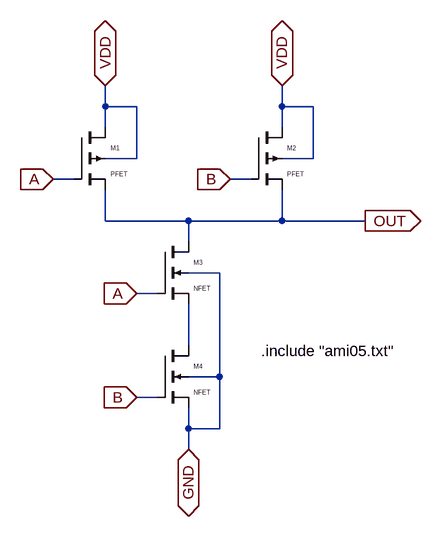
[diagram p0: schematic nand2.asc]
nand2.asc, the LTspice schematic file:
Version 4
SHEET 1 2772 1756
WIRE 784 752 784 720
WIRE 832 752 784 752
WIRE 1056 752 1056 720
WIRE 1104 752 1056 752
WIRE 784 784 784 752
WIRE 1056 784 1056 752
WIRE 832 832 832 752
WIRE 832 832 784 832
WIRE 1104 832 1104 752
WIRE 1104 832 1056 832
WIRE 736 864 704 864
WIRE 1008 864 976 864
WIRE 784 928 784 880
WIRE 912 928 784 928
WIRE 1056 928 1056 880
WIRE 1056 928 912 928
WIRE 1184 928 1056 928
WIRE 912 960 912 928
WIRE 960 1008 912 1008
WIRE 864 1040 832 1040
WIRE 912 1120 912 1056
WIRE 960 1168 960 1008
WIRE 960 1168 912 1168
WIRE 864 1200 832 1200
WIRE 912 1248 912 1216
WIRE 960 1248 960 1168
WIRE 960 1248 912 1248
WIRE 912 1280 912 1248
FLAG 912 1280 GND
IOPIN 912 1280 BiDir
FLAG 832 1040 A
IOPIN 832 1040 In
FLAG 832 1200 B
IOPIN 832 1200 In
FLAG 784 720 VDD
IOPIN 784 720 BiDir
FLAG 1056 720 VDD
IOPIN 1056 720 BiDir
FLAG 704 864 A
IOPIN 704 864 In
FLAG 976 864 B
IOPIN 976 864 In
FLAG 1184 928 OUT
IOPIN 1184 928 Out
SYMBOL nmos4 864 960 R0
WINDOW 0 56 32 Left 0
WINDOW 3 56 72 Left 0
SYMATTR InstName M3
SYMATTR Value NFET
SYMATTR Value2 l=0.6u w=3u
SYMBOL pmos4 736 784 R0
WINDOW 0 56 32 Left 0
WINDOW 3 56 72 Left 0
SYMATTR InstName M1
SYMATTR Value PFET
SYMATTR Value2 l=0.6u w=3u
SYMBOL pmos4 1008 784 R0
WINDOW 0 56 32 Left 0
WINDOW 3 56 72 Left 0
SYMATTR InstName M2
SYMATTR Value PFET
SYMATTR Value2 l=0.6u w=3u
SYMBOL nmos4 864 1120 R0
WINDOW 0 56 32 Left 0
WINDOW 3 56 72 Left 0
SYMATTR InstName M4
SYMATTR Value NFET
SYMATTR Value2 l=0.6u w=3u
TEXT 1024 1128 Left 2 !.include "ami05.txt"

The netlist it stands for:
* nand2.asc
M3 OUT A N001 GND NFET l=0.6u w=3u
M1 VDD A OUT VDD PFET l=0.6u w=3u
M2 VDD B OUT VDD PFET l=0.6u w=3u
M4 N001 B GND GND NFET l=0.6u w=3u
.model NMOS NMOS
.model PMOS PMOS
.lib standard.mos
.include "ami05.txt"
.backanno
.end